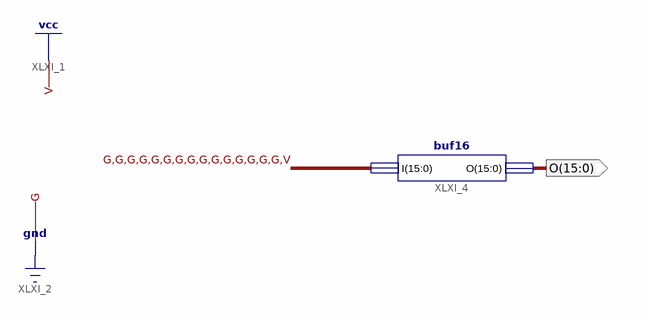
[diagram p0: schematic sheet 1]
// Xilinx ISE schematic constant1.sch (spartan3adsp) as structural Verilog: 1 symbols, 1 ports
module constant1 (
  output [15:0] O
);

  buf16 XLXI_4 (.I(16'b0000000000000001), .O(O));
endmodule
